# Altium project PCB_Project2.PrjPCB
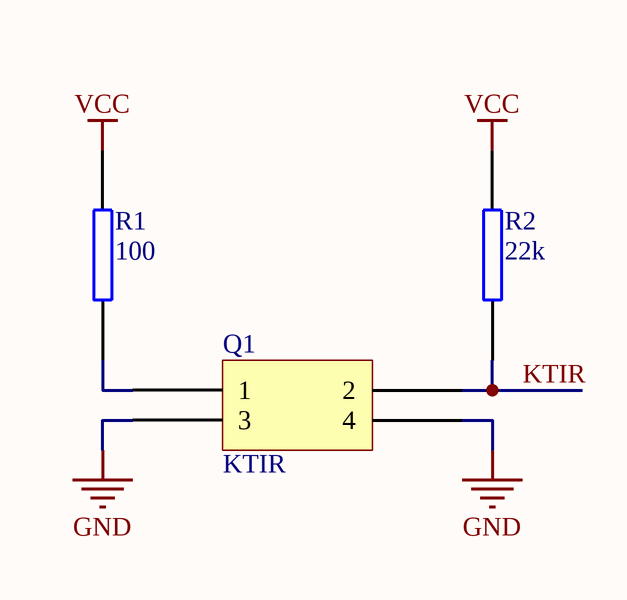
[diagram p0: KTIR.SchDoc]
1 sheet, 3 parts. Net scope: global (net labels, ports and power ports of the same name join across sheets).
Board file: KTIR.PcbDoc

## Sheet KTIR.SchDoc
size A4

### Parts
Q1  KTIR  [KTIR0711S]
R1  100  [0805 RES]
R2  22k  [0805 RES]

### Nets
GND: Q1.3 Q1.4
VCC: R1.1 R2.1
KTIR: Q1.2 R2.2
NetQ1_1: Q1.1 R1.2

### Library data of the parts
R1 R2 = R